# EAGLE design KeyMux40 (EAGLE 6.5.0)
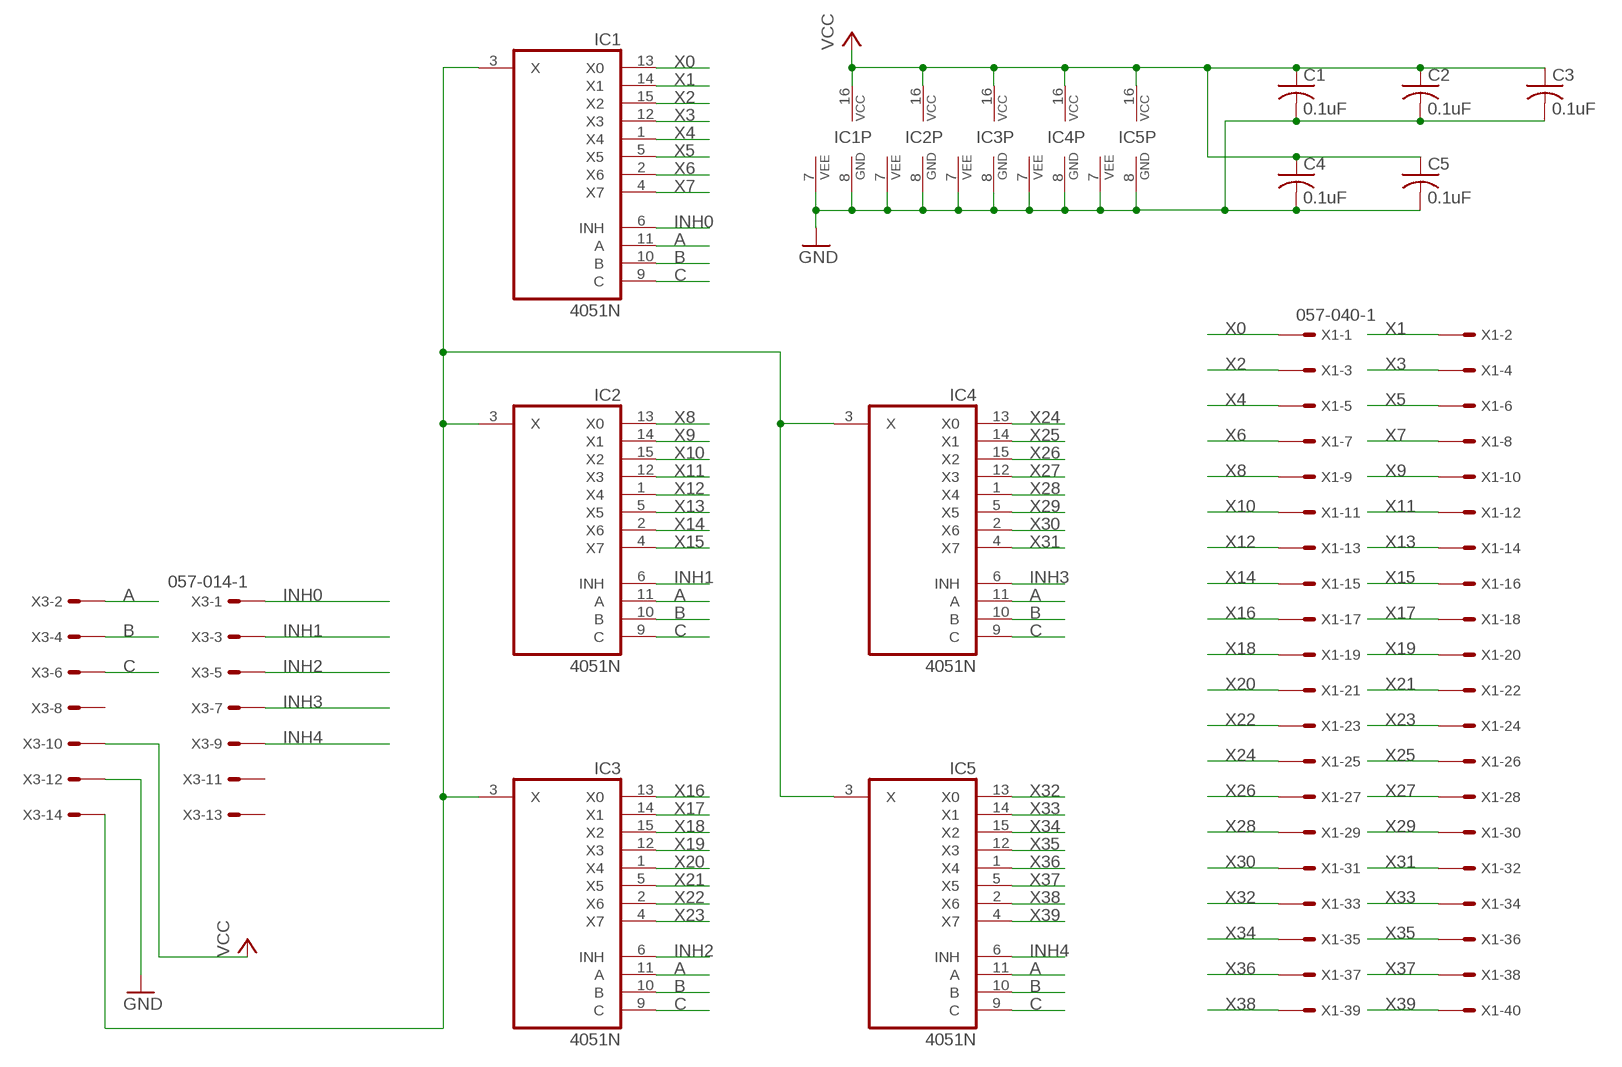
[diagram p0: schematic, sheet 1]

## Parts
C1  0.1uF  C-US025-025X050  [C025-025X050]
C2  0.1uF  C-US025-025X050  [C025-025X050]
C3  0.1uF  C-US025-025X050  [C025-025X050]
C4  0.1uF  C-US025-025X050  [C025-025X050]
C5  0.1uF  C-US025-025X050  [C025-025X050]
IC1  4051N  [DIL16]
IC2  4051N  [DIL16]
IC3  4051N  [DIL16]
IC4  4051N  [DIL16]
IC5  4051N  [DIL16]
X1  057-040-1  [057-040-1]
X3  057-014-1  [057-014-1]

## Nets
A: IC1.11(A) IC2.11(A) IC3.11(A) IC4.11(A) IC5.11(A) X3.2
B: IC1.10(B) IC2.10(B) IC3.10(B) IC4.10(B) IC5.10(B) X3.4
C: IC1.9(C) IC2.9(C) IC3.9(C) IC4.9(C) IC5.9(C) X3.6
GND [ground]: C1.2 C2.2 C3.2 C4.2 C5.2 IC1.7(VEE) IC1.8(GND) IC2.7(VEE) IC2.8(GND) IC3.7(VEE) IC3.8(GND) IC4.7(VEE) IC4.8(GND) IC5.7(VEE) IC5.8(GND) X3.12
INH0: IC1.6(INH) X3.1
INH1: IC2.6(INH) X3.3
INH2: IC3.6(INH) X3.5
INH3: IC4.6(INH) X3.7
INH4: IC5.6(INH) X3.9
N$2: IC1.3(X) IC2.3(X) IC3.3(X) IC4.3(X) IC5.3(X) X3.14
VCC [ground]: C1.1 C2.1 C3.1 C4.1 C5.1 IC1.16(VCC) IC2.16(VCC) IC3.16(VCC) IC4.16(VCC) IC5.16(VCC) X3.10
X0: IC1.13(X0) X1.1
X1: IC1.14(X1) X1.2
X2: IC1.15(X2) X1.3
X3: IC1.12(X3) X1.4
X4: IC1.1(X4) X1.5
X5: IC1.5(X5) X1.6
X6: IC1.2(X6) X1.7
X7: IC1.4(X7) X1.8
X8: IC2.13(X0) X1.9
X9: IC2.14(X1) X1.10
X10: IC2.15(X2) X1.11
X11: IC2.12(X3) X1.12
X12: IC2.1(X4) X1.13
X13: IC2.5(X5) X1.14
X14: IC2.2(X6) X1.15
X15: IC2.4(X7) X1.16
X16: IC3.13(X0) X1.17
X17: IC3.14(X1) X1.18
X18: IC3.15(X2) X1.19
X19: IC3.12(X3) X1.20
X20: IC3.1(X4) X1.21
X21: IC3.5(X5) X1.22
X22: IC3.2(X6) X1.23
X23: IC3.4(X7) X1.24
X24: IC4.13(X0) X1.25
X25: IC4.14(X1) X1.26
X26: IC4.15(X2) X1.27
X27: IC4.12(X3) X1.28
X28: IC4.1(X4) X1.29
X29: IC4.5(X5) X1.30
X30: IC4.2(X6) X1.31
X31: IC4.4(X7) X1.32
X32: IC5.13(X0) X1.33
X33: IC5.14(X1) X1.34
X34: IC5.15(X2) X1.35
X35: IC5.12(X3) X1.36
X36: IC5.1(X4) X1.37
X37: IC5.5(X5) X1.38
X38: IC5.2(X6) X1.39
X39: IC5.4(X7) X1.40
Unconnected: X3.8 X3.11 X3.13

## Library data of the parts
C1-C5 = rcl:C-US: CAPACITOR, American symbol
IC1-IC5 = 40xx:4051: 8-channel ANALOG MULTIPLEXER
X1 = con-panduit:057-040-: CONNECTOR 40-pin series 057 contact pc board low profile headers; OC_FARNELL: unknown; OC_NEWARK: unknown
X3 = con-panduit:057-014-: CONNECTOR 10-pin series 057 contact pc board low profile headers; OC_FARNELL: unknown; OC_NEWARK: unknown

## Net classes
0 default: width 0.203 mm
1 ground: width 0.406 mm

## Board
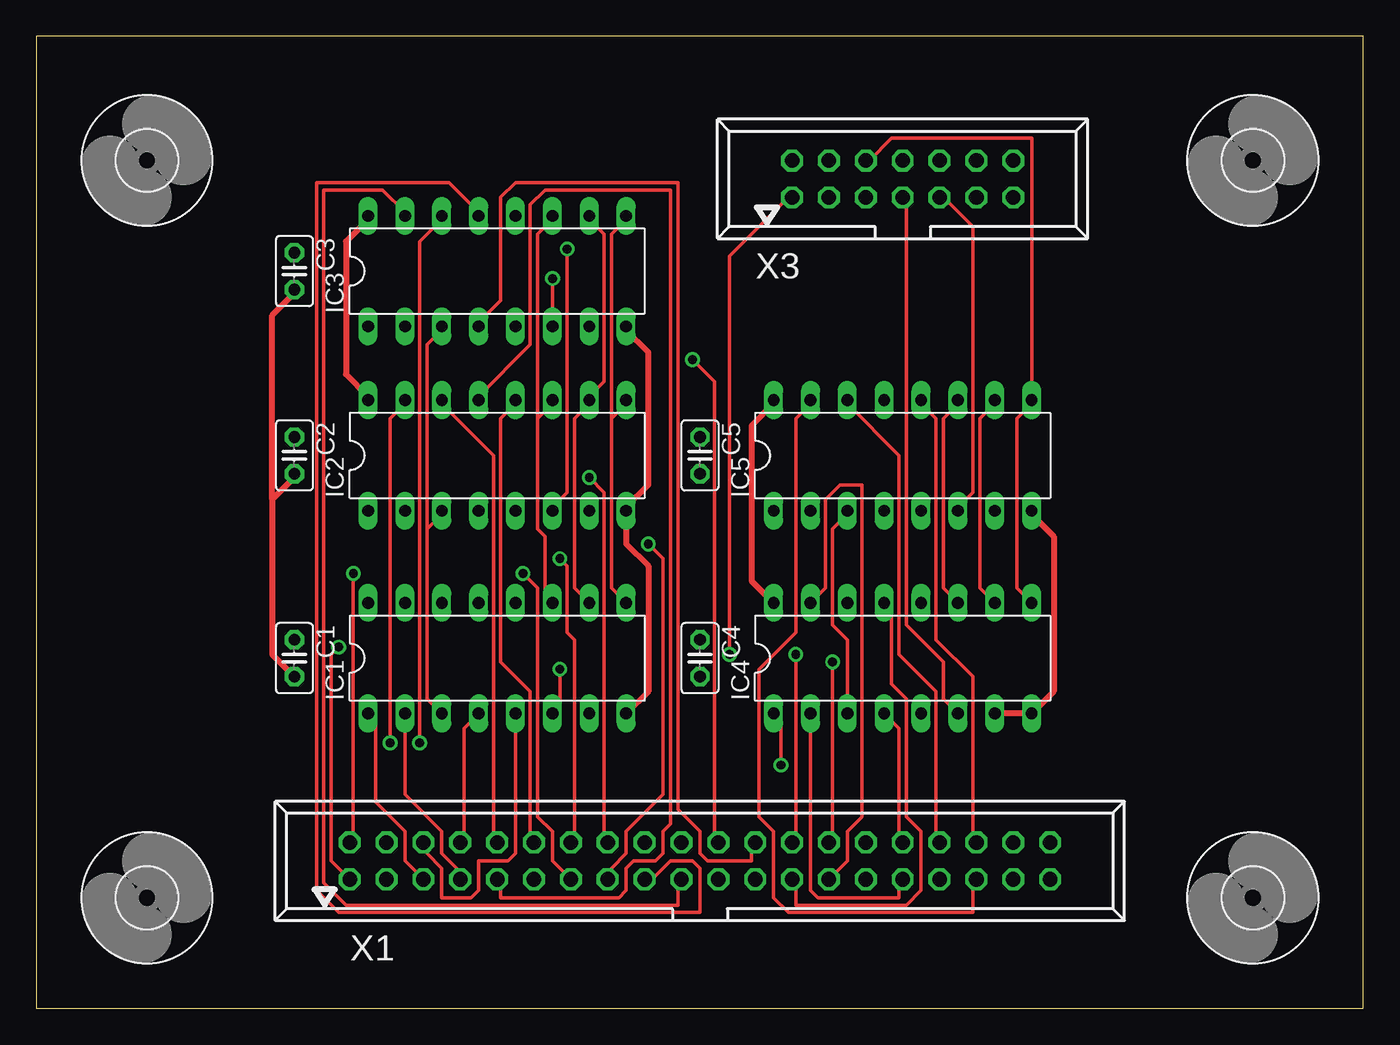
[diagram p1: board, top side]
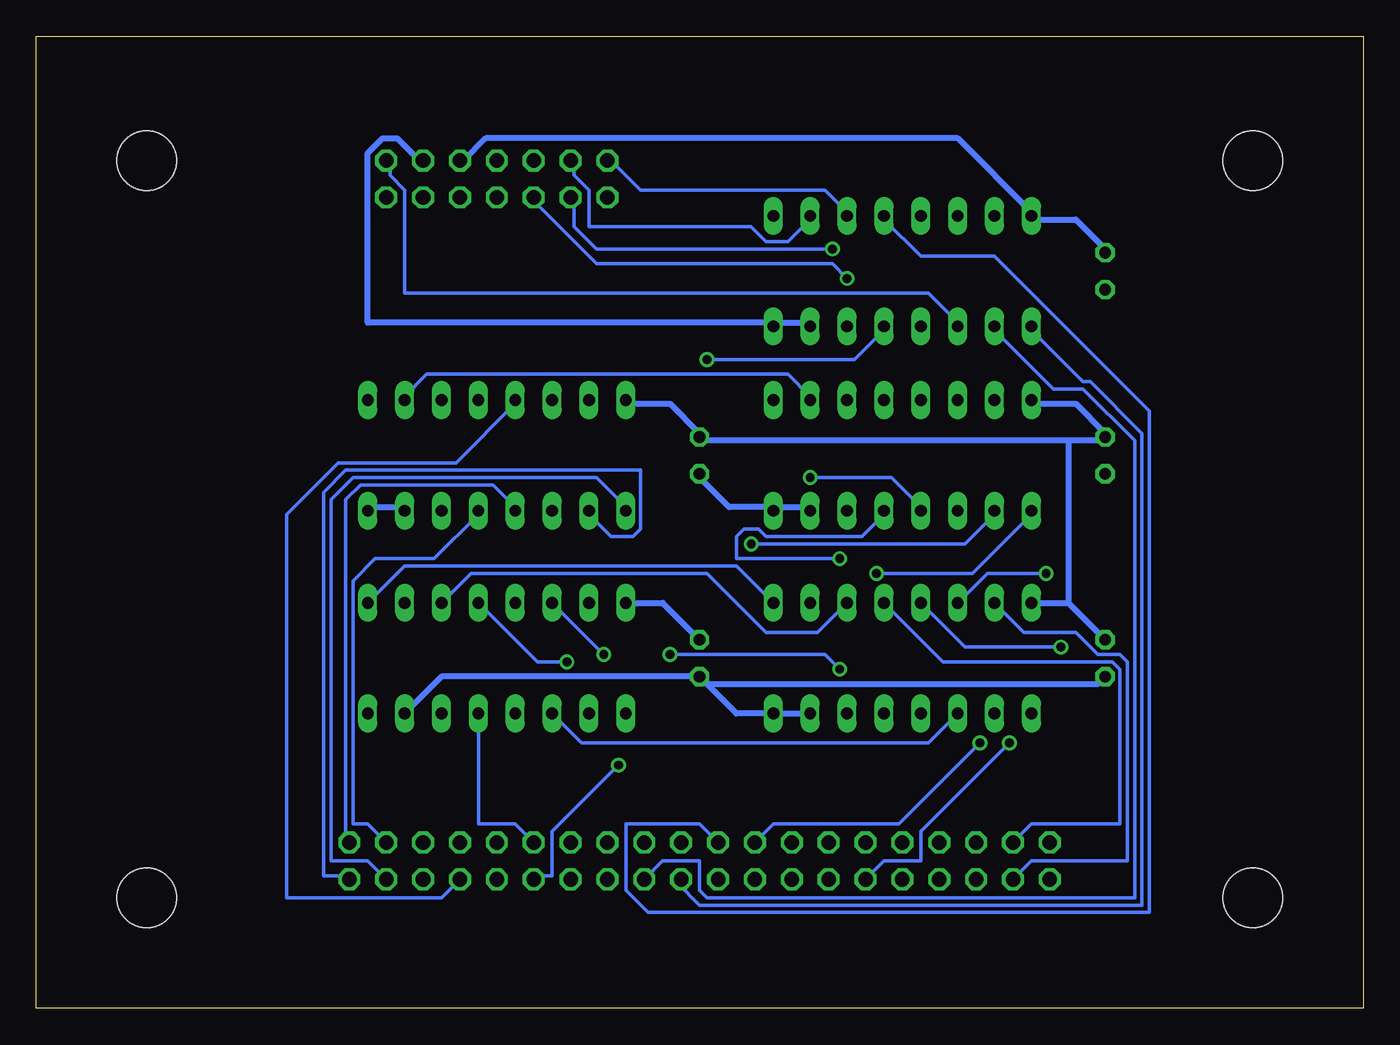
[diagram p2: board, bottom side, seen from below]

Size 91.42 x 66.98 mm. Coordinates in mm from the lower left corner, seen from the top.
Outline: 0,0 91.42,0 91.42,66.98 0,66.98 0,0
Copper layers (1*16): Top 0.035mm / dielectric 1.5mm / Bottom 0.035mm
Design rules "default": minimum track width 10mil, minimum drill 24mil, track to track 8mil, track to pad 8mil, pad to pad 8mil, via to via 8mil, smd to smd 8mil, copper to edge 40mil, drill to drill 8mil, minimum pad ring 10mil, minimum via ring 8mil, stop-mask expansion 4mil, vias tented up to drill 0mil, thermal gap 10mil

### Footprints (pad centres in the part's own frame; a part is rotated, then mirrored left to right if it is on the bottom)
C025-025X050 = drill 0.813 octagon: 1 -1.27,0; 2 1.27,0
DIL16 = drill 0.813 long: 1 -8.89,-3.81; 2 -6.35,-3.81; 3 -3.81,-3.81; 4 -1.27,-3.81; 5 1.27,-3.81; 6 3.81,-3.81; 7 6.35,-3.81; 8 8.89,-3.81; 9 8.89,3.81; 10 6.35,3.81; 11 3.81,3.81; 12 1.27,3.81; 13 -1.27,3.81; 14 -3.81,3.81; 15 -6.35,3.81; 16 -8.89,3.81
4,1 = hole 4.1: 0,0
057-040-1 = drill 1 octagon: 1 -24.13,-1.27; 2 -24.13,1.27; 3 -21.59,-1.27; 4 -21.59,1.27; 5 -19.05,-1.27; 6 -19.05,1.27; 7 -16.51,-1.27; 8 -16.51,1.27; 9 -13.97,-1.27; 10 -13.97,1.27; 11 -11.43,-1.27; 12 -11.43,1.27; 13 -8.89,-1.27; 14 -8.89,1.27; 15 -6.35,-1.27; 16 -6.35,1.27; 17 -3.81,-1.27; 18 -3.81,1.27; 19 -1.27,-1.27; 20 -1.27,1.27; 21 1.27,-1.27; 22 1.27,1.27; 23 3.81,-1.27; 24 3.81,1.27; 25 6.35,-1.27; 26 6.35,1.27; 27 8.89,-1.27; 28 8.89,1.27; 29 11.43,-1.27; 30 11.43,1.27; 31 13.97,-1.27; 32 13.97,1.27; 33 16.51,-1.27; 34 16.51,1.27; 35 19.05,-1.27; 36 19.05,1.27; 37 21.59,-1.27; 38 21.59,1.27; 39 24.13,-1.27; 40 24.13,1.27
057-014-1 = drill 1 octagon: 1 -7.62,-1.27; 2 -7.62,1.27; 3 -5.08,-1.27; 4 -5.08,1.27; 5 -2.54,-1.27; 6 -2.54,1.27; 7 0,-1.27; 8 0,1.27; 9 2.54,-1.27; 10 2.54,1.27; 11 5.08,-1.27; 12 5.08,1.27; 13 7.62,-1.27; 14 7.62,1.27

### Placement (x,y rotation side)
C1  17.78,24.13 270 top
C2  17.78,38.1 270 top
C3  17.78,50.8 270 top
C4  45.72,24.13 270 top
C5  45.72,38.1 270 top
IC1  31.75,24.13 0 top
IC2  31.75,38.1 0 top
IC3  31.75,50.8 0 top
IC4  59.69,24.13 0 top
IC5  59.69,38.1 0 top
U$1  [4,1]  7.62,7.62 0 top
U$2  [4,1]  7.62,58.42 0 top
U$3  [4,1]  83.82,7.62 0 top
U$4  [4,1]  83.82,58.42 0 top
X1  45.72,10.16 0 top
X3  59.69,57.15 0 top

### Tracks (layer width: path | path; a pad name or v marks a point on that pad's centre or on a via)
A
  Top 0.254: IC4.11 62.48,28.96 62.48,40.64 63.5,41.66 IC5.11 | IC1.11 35.05,28.45 35.05,32.51 34.54,33.02 34.54,40.64 | 34.54,40.64 35.56,41.66 IC2.11 | 34.54,40.64 34.54,53.34 35.56,54.36 IC3.11
  Bottom 0.254: X3.2 51.82,58.42 49.78,56.39 37.08,56.39 35.56,54.86 IC3.11 | IC4.11 61.47,29.97 45.21,29.97 41.15,25.91 37.59,25.91 IC1.11
B
  Top 0.254: IC4.10 65.02,28.96 65.02,40.64 66.04,41.66 IC5.10 | IC1.10 37.08,28.96 37.08,40.64 38.1,41.66 IC2.10 38.1,42.16 39.12,43.18 39.12,53.34 38.1,54.36 IC3.10
  Bottom 0.254: X3.4 54.36,58.42 54.36,57.4 53.34,56.39 53.34,53.85 42.16,53.85 41.15,52.83 39.62,52.83 38.1,54.36 IC3.10 | IC5.10 66.04,42.16 64.52,43.69 39.62,43.69 38.1,42.16 IC2.10
C
  Top 0.254: IC1.9 39.62,28.96 39.62,40.64 | 39.62,40.64 40.64,41.66 IC2.9 | 39.62,40.64 39.62,53.34 40.64,54.36 IC3.9 | IC4.9 67.56,28.96 67.56,40.64 68.58,41.66 IC5.9 68.58,59.94 58.93,59.94 57.4,58.42 X3.6
  Bottom 0.254: IC1.9 43.18,30.48 66.04,30.48 IC4.9
GND
  Top 0.406: C1.2 16.26,24.38 16.26,35.05 | 16.26,35.05 17.78,36.58 C2.2 | 16.26,35.05 16.26,47.75 17.78,49.28 C3.2 | IC4.7 IC4.8 70.1,21.84 70.1,32.51 68.58,34.04 IC5.8 | IC1.8 42.16,21.84 42.16,30.48 40.64,32 IC2.8 40.64,34.54 42.16,36.07 42.16,45.21 40.64,46.74 IC3.8
  Bottom 0.406: 40.64,47.24 38.1,47.24 IC3.7 | 40.64,47.24 68.58,47.24 68.58,58.93 67.56,59.94 66.55,59.94 65.02,58.42 X3.12 | 40.64,47.24 IC3.8 | IC5.7 66.04,34.54 68.58,34.54 IC5.8 | IC1.7 IC1.8 43.18,20.32 45.21,22.35 | 45.21,22.35 C4.2 63.5,22.86 IC4.7 | 40.64,34.54 38.1,34.54 IC2.7 | 40.64,34.54 43.69,34.54 45.72,36.58 C5.2 | 40.64,34.54 IC2.8 | C1.2 18.29,22.35 45.21,22.35
INH0  (via drill 0.61)
  Top 0.254: IC1.6 36.07,20.83 v36.07,23.37 | v47.75,24.38 47.75,51.82 51.82,55.88 X3.1
  Bottom 0.254: v36.07,23.37 37.08,24.38 v47.75,24.38
INH1  (via drill 0.61)
  Top 0.254: v36.58,52.32 36.58,35.56 35.56,34.54 IC2.6
  Bottom 0.254: v36.58,52.32 52.83,52.32 54.36,53.85 54.36,55.88 X3.3
INH2  (via drill 0.61)
  Top 0.254: v35.56,50.29 IC3.6
  Bottom 0.254: v35.56,50.29 36.58,51.31 52.83,51.31 57.4,55.88 X3.5
INH3
  Top 0.254: IC4.6 62.48,21.34 62.48,23.88 59.94,26.42 59.94,55.88 X3.7
INH4
  Top 0.254: IC5.6 63.5,34.54 64.52,35.56 64.52,53.85 62.48,55.88 X3.9
N$2
  Top 0.254: IC4.3 55.88,25.4 54.86,26.42 54.86,33.02 55.88,34.04 IC5.3 | IC1.3 26.92,21.34 26.92,33.02 | 26.92,33.02 27.94,34.04 IC2.3 | 26.92,33.02 26.92,45.72 27.94,46.74 IC3.3
  Bottom 0.254: X3.14 67.06,58.42 67.06,57.4 66.04,56.39 66.04,49.28 29.97,49.28 27.94,47.24 IC3.3 | IC4.3 53.85,18.29 29.97,18.29 IC1.3
VCC
  Top 0.406: IC4.16 49.28,29.46 49.28,40.13 50.8,41.66 IC5.16 | IC2.16 22.86,42.16 21.34,43.69 21.34,52.83 22.86,54.36 IC3.16
  Bottom 0.406: C4.1 48.26,27.94 IC4.16 | IC5.16 50.8,41.66 47.75,41.66 45.72,39.62 C5.1 45.72,39.12 20.32,39.12 | 20.32,27.94 C1.1 | IC1.16 20.32,27.94 | IC2.16 22.86,41.66 19.81,41.66 17.78,39.62 C2.1 17.78,39.12 20.32,39.12 | 20.32,39.12 20.32,27.94 | C3.1 17.78,52.32 19.81,54.36 22.86,54.36 IC3.16 22.86,54.86 27.94,59.94 60.45,59.94 61.98,58.42 X3.10
X0  (via drill 0.61)
  Top 0.254: v20.83,24.89 20.32,24.38 20.32,10.16 X1.1
  Bottom 0.254: IC1.13 27.43,24.89 v20.83,24.89
X1  (via drill 0.61)
  Top 0.254: v21.84,29.97 21.84,11.68 X1.2
  Bottom 0.254: IC1.14 25.91,29.97 v21.84,29.97
X2
  Bottom 0.254: IC1.15 23.37,25.91 19.81,25.91 18.29,24.38 16.76,24.38 16.26,23.88 16.26,10.16 22.86,10.16 X1.3
X3
  Bottom 0.254: IC1.12 28.96,23.88 17.27,23.88 16.76,23.37 16.76,12.7 22.86,12.7 X1.4
X4
  Top 0.254: IC1.1 23.37,19.81 23.37,14.22 25.4,12.19 25.4,10.16 X1.5
X5
  Top 0.254: IC1.5 33.02,10.67 32.51,10.16 30.48,10.16 30.48,8.13 29.97,7.62 27.94,7.62 27.94,9.65 26.92,10.67 26.92,11.18 X1.6
X6
  Top 0.254: IC1.2 25.4,14.73 27.94,12.19 27.94,10.67 28.96,9.65 28.96,9.14 X1.7
X7
  Top 0.254: IC1.4 29.46,19.3 29.46,11.68 X1.8
X8
  Top 0.254: IC2.13 30.48,42.16 34.04,45.72 34.04,55.37 35.05,56.39 43.69,56.39 43.69,12.7 43.18,12.19 43.18,10.67 42.67,10.16 41.15,10.16 40.64,9.65 40.64,8.13 40.13,7.62 32,7.62 32,8.64 X1.9
X9
  Top 0.254: IC2.14 27.94,41.66 31.5,38.1 31.5,11.68 X1.10
X10  (via drill 0.61)
  Top 0.254: v24.38,18.29 24.38,40.64 25.4,41.66 IC2.15
  Bottom 0.254: v24.38,18.29 30.48,12.19 30.48,10.16 33.02,10.16 X1.11
X11
  Top 0.254: IC2.12 33.02,41.66 32,40.64 32,23.88 34.04,21.84 34.04,11.68 X1.12
X12  (via drill 0.61)
  Top 0.254: v33.53,29.97 34.54,28.96 34.54,13.21 35.56,12.19 35.56,10.16 X1.13
  Bottom 0.254: v33.53,29.97 26.92,29.97 22.86,34.04 IC2.1
X13  (via drill 0.61)
  Top 0.254: v36.07,30.99 36.58,30.48 36.58,25.91 37.08,25.4 37.08,11.68 X1.14
  Bottom 0.254: v36.07,30.99 43.18,30.99 43.18,32.51 42.67,33.02 41.66,33.02 41.15,32.51 34.54,32.51 33.02,34.04 IC2.5
X14  (via drill 0.61)
  Top 0.254: v42.16,32 43.18,30.99 43.18,14.73 40.64,12.19 40.64,10.67 39.62,9.65 39.62,9.14 X1.15
  Bottom 0.254: v42.16,32 27.43,32 25.4,34.04 IC2.2
X15  (via drill 0.61)
  Top 0.254: v38.1,36.58 39.12,35.56 39.12,11.68 X1.16
  Bottom 0.254: v38.1,36.58 32.51,36.58 30.48,34.54 IC2.4
X16
  Top 0.254: IC3.13 30.48,54.86 28.45,56.9 19.3,56.9 19.3,8.13 20.83,6.6 45.72,6.6 45.72,9.65 45.21,10.16 43.69,10.16 42.16,8.64 X1.17
X17  (via drill 0.61)
  Top 0.254: v26.42,18.29 26.42,52.83 27.94,54.36 IC3.14
  Bottom 0.254: v26.42,18.29 32,12.7 40.64,12.7 X1.18
X18
  Top 0.254: IC3.15 25.4,54.86 23.88,56.39 19.81,56.39 19.81,8.64 21.34,7.11 44.2,7.11 44.2,8.64 X1.19
X19
  Bottom 0.254: X1.20 45.72,12.7 50.8,12.7 50.8,8.13 49.28,6.6 14.73,6.6 14.73,41.15 25.4,51.82 30.48,51.82 33.02,54.36 IC3.12
X20
  Bottom 0.254: IC3.1 22.86,46.74 19.3,43.18 18.8,43.18 15.24,39.62 15.24,7.11 45.72,7.11 47.24,8.64 X1.21
X21  (via drill 0.61)
  Top 0.254: v45.21,44.7 46.74,43.18 46.74,11.68 X1.22
  Bottom 0.254: v45.21,44.7 35.05,44.7 33.02,46.74 IC3.5
X22
  Bottom 0.254: X1.23 48.26,10.16 45.72,10.16 45.72,8.13 45.21,7.62 15.75,7.62 15.75,39.12 19.3,42.67 21.34,42.67 25.4,46.74 IC3.2
X23
  Top 0.254: IC3.4 30.48,47.24 32,48.77 32,55.88 33.02,56.9 44.2,56.9 44.2,13.72 45.72,12.19 45.72,10.67 46.23,10.16 49.28,10.16 49.28,11.18 X1.24
X24
  Top 0.254: IC4.13 58.93,27.43 58.93,22.35 59.94,21.34 59.94,13.21 60.96,12.19 60.96,8.13 59.94,7.11 52.32,7.11 52.32,8.64 X1.25
X25  (via drill 0.61)
  Top 0.254: v52.32,24.38 52.32,11.68 X1.26
  Bottom 0.254: v52.32,24.38 IC4.14
X26
  Top 0.254: IC4.15 54.36,28.96 54.36,35.05 55.37,36.07 56.9,36.07 56.9,13.21 55.88,12.19 55.88,10.16 X1.27
X27  (via drill 0.61)
  Top 0.254: v54.86,23.88 54.86,11.68 X1.28
  Bottom 0.254: IC4.12 56.9,23.88 v54.86,23.88
X28  (via drill 0.61)
  Top 0.254: IC4.1 51.31,19.81 v51.31,16.76
  Bottom 0.254: v51.31,16.76 55.88,12.19 55.88,9.14 56.9,9.14 X1.29
X29
  Bottom 0.254: IC4.5 60.96,12.7 58.42,12.7 X1.30
X30
  Top 0.254: IC4.2 53.34,8.13 53.85,7.62 59.44,7.62 59.44,8.64 X1.31
X31
  Top 0.254: IC4.4 59.44,19.3 59.44,11.68 X1.32
X32
  Bottom 0.254: X1.33 63.5,7.62 74.17,7.62 74.17,34.04 70.61,37.59 62.48,37.59 58.42,41.66 IC5.13
X33
  Top 0.254: IC5.14 55.88,41.66 59.44,38.1 59.44,24.38 61.98,21.84 61.98,11.68 X1.34
X34
  Top 0.254: IC5.15 53.34,41.66 52.32,40.64 52.32,25.91 49.78,23.37 49.78,13.21 50.8,12.19 50.8,7.62 51.82,6.6 64.52,6.6 64.52,8.64 X1.35
X35
  Top 0.254: IC5.12 60.96,41.66 61.98,40.64 61.98,25.4 64.52,22.86 64.52,11.68 X1.36
X36
  Bottom 0.254: X1.37 68.58,10.16 71.12,10.16 71.12,35.05 69.6,36.58 52.83,36.58 50.8,34.54 IC5.1
X37
  Bottom 0.254: X1.38 68.58,12.7 69.6,12.7 69.6,29.46 68.07,30.99 64.01,30.99 60.96,34.04 IC5.5
X38
  Bottom 0.254: IC5.2 53.34,34.04 51.82,32.51 50.29,32.51 49.78,33.02 49.78,37.08 70.1,37.08 71.63,35.56 71.63,9.14 70.1,9.14 X1.39
X39
  Bottom 0.254: IC5.4 58.42,34.54 59.94,36.07 69.09,36.07 70.1,35.05 70.1,11.68 X1.40